# EAGLE design camera_final (EAGLE 7.5.0)
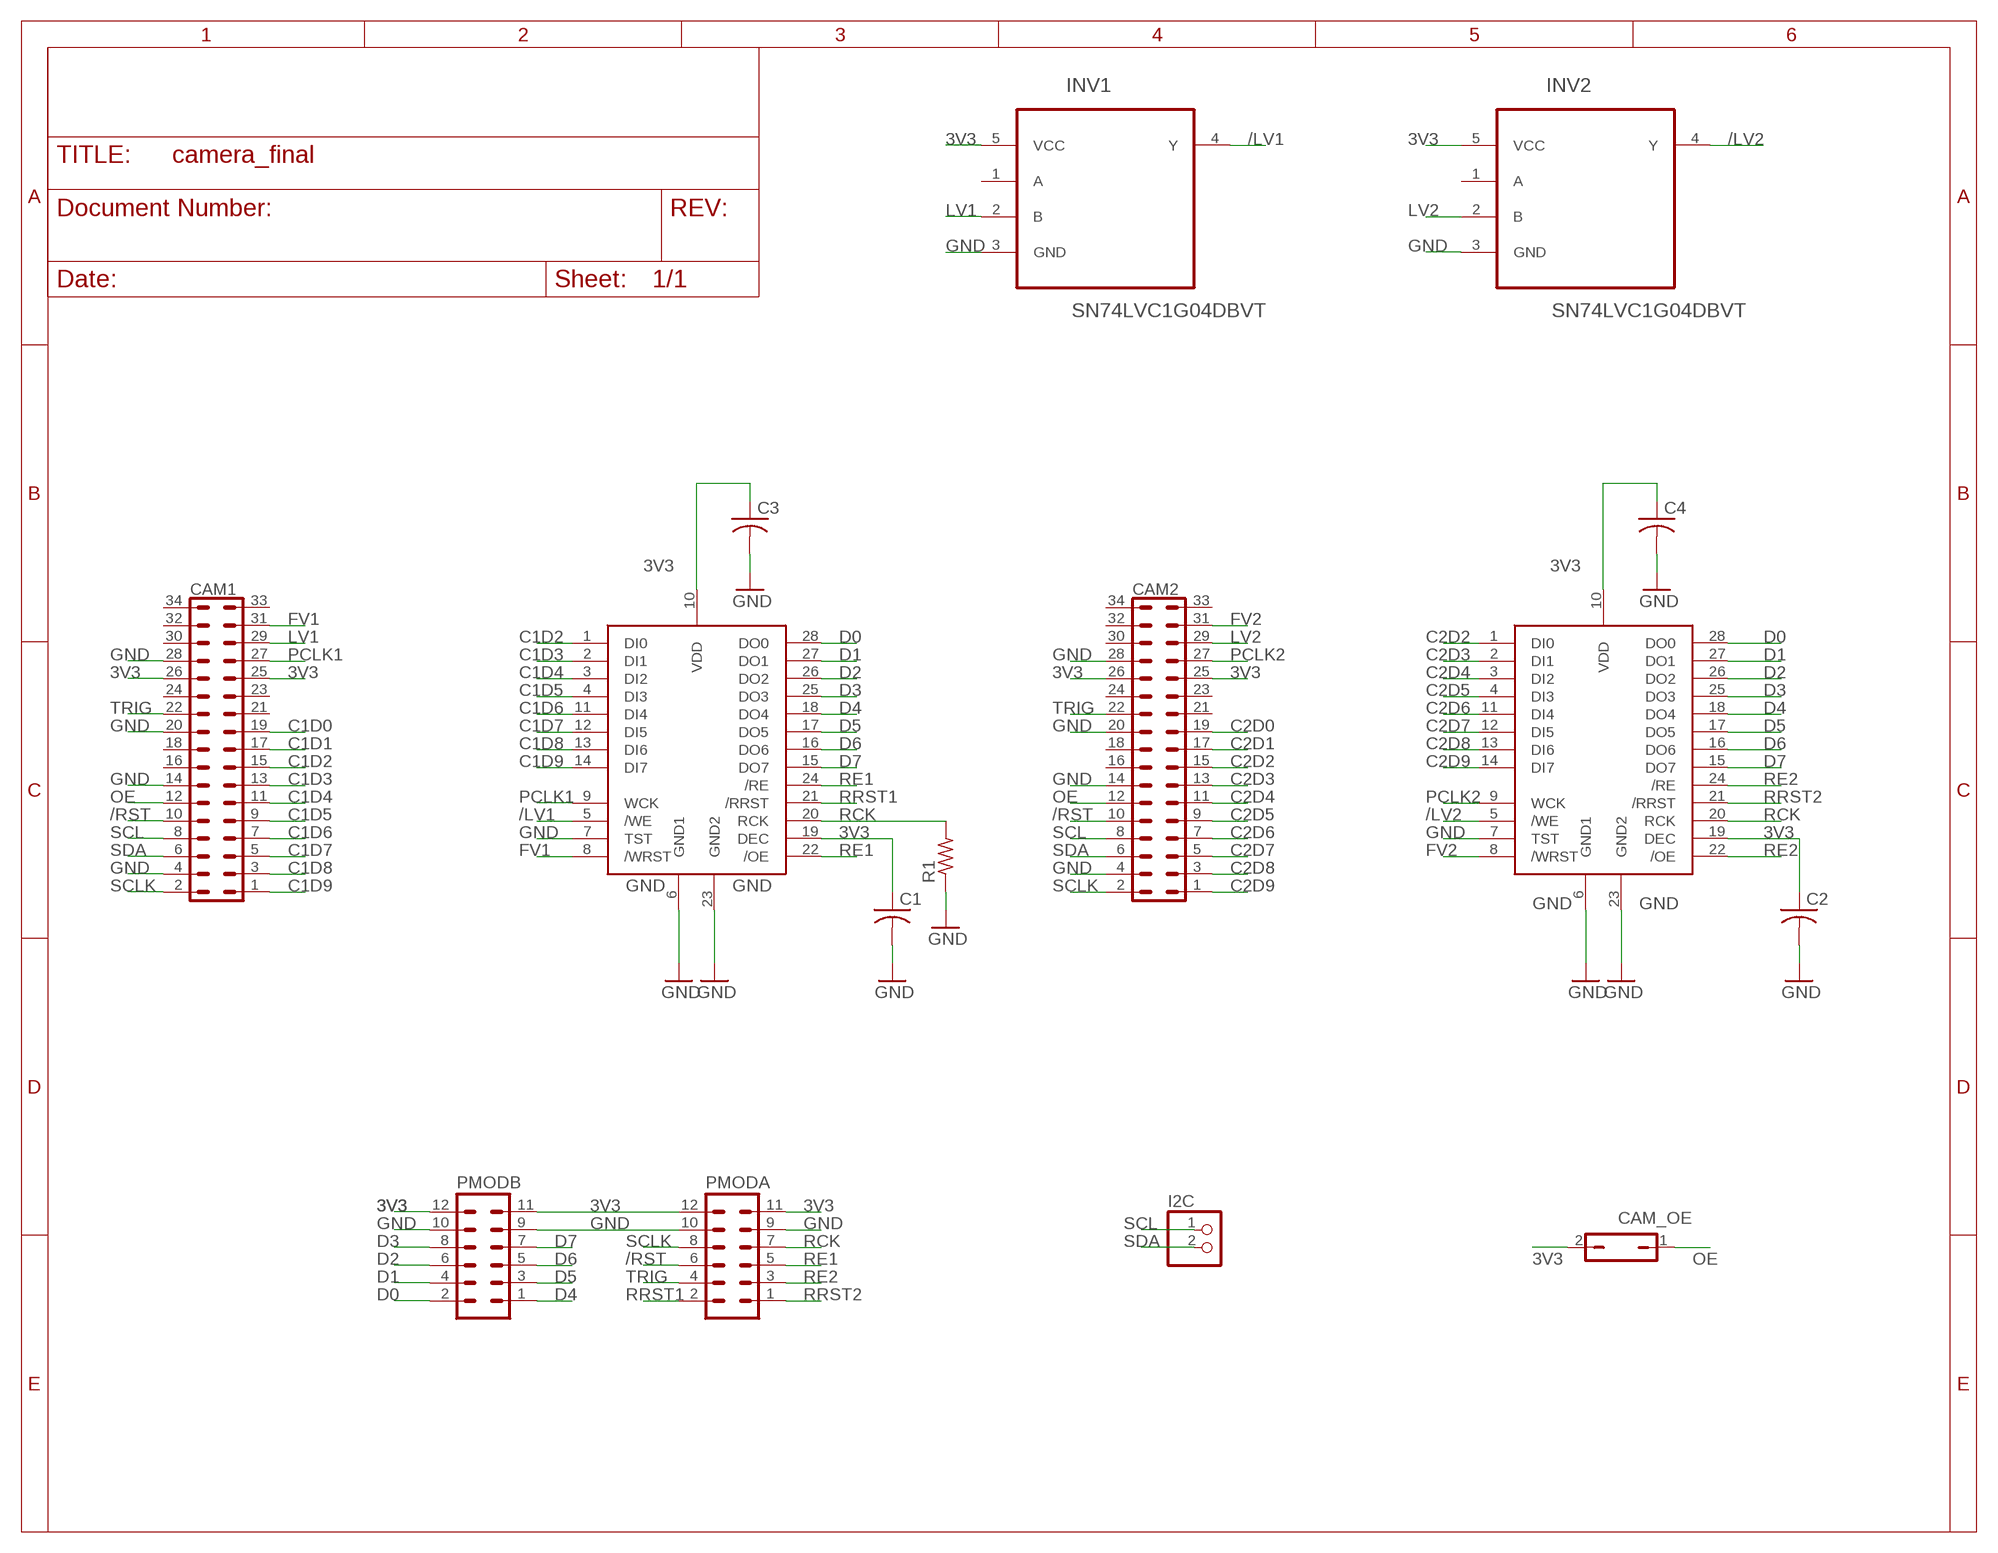
[diagram p0: schematic, sheet 1]

## Parts
C1  C-USC0805K  [C0805K]
C2  C-USC0805K  [C0805K]
C3  C-USC0805K  [C0805K]
C4  C-USC0805K  [C0805K]
CAM1  PHB_1MM27_2X17_SNT  [PHB_1MM27_2X17_SNT]
CAM2  PHB_1MM27_2X17_SNT  [PHB_1MM27_2X17_SNT]
CAM_OE  JP1Q  [JP1]
I2C  PINHD-1X2  [1X02]
INV1  SN74LVC1G04DBVT  SN74LVC1G08DBVT  [SOT95P280X145-5N]
INV2  SN74LVC1G04DBVT  SN74LVC1G08DBVT  [SOT95P280X145-5N]
PMODA  MA06-2  [MA06-2]
PMODB  MA06-2  [MA06-2]
R1  R-US_R0805  [R0805]
U$1  AL422B  [SOP28]
U$2  AL422B  [SOP28]

## Nets
3V3: C1.1 C2.1 C3.1 C4.1 CAM1.25 CAM1.26 CAM2.25 CAM2.26 CAM_OE.2 INV1.5(VCC) INV2.5(VCC) PMODA.11 PMODA.12 PMODB.11 PMODB.12 U$1.10(VDD) U$1.19(DEC) U$2.10(VDD) U$2.19(DEC)
/LV1: INV1.4(Y) U$2.5(/WE)
/LV2: INV2.4(Y) U$1.5(/WE)
/RST: CAM1.10 CAM2.10 PMODA.6
C1D0: CAM1.19
C1D1: CAM1.17
C1D2: CAM1.15 U$2.1(DI0)
C1D3: CAM1.13 U$2.2(DI1)
C1D4: CAM1.11 U$2.3(DI2)
C1D5: CAM1.9 U$2.4(DI3)
C1D6: CAM1.7 U$2.11(DI4)
C1D7: CAM1.5 U$2.12(DI5)
C1D8: CAM1.3 U$2.13(DI6)
C1D9: CAM1.1 U$2.14(DI7)
C2D0: CAM2.19
C2D1: CAM2.17
C2D2: CAM2.15 U$1.1(DI0)
C2D3: CAM2.13 U$1.2(DI1)
C2D4: CAM2.11 U$1.3(DI2)
C2D5: CAM2.9 U$1.4(DI3)
C2D6: CAM2.7 U$1.11(DI4)
C2D7: CAM2.5 U$1.12(DI5)
C2D8: CAM2.3 U$1.13(DI6)
C2D9: CAM2.1 U$1.14(DI7)
D0: PMODB.2 U$1.28(DO0) U$2.28(DO0)
D1: PMODB.4 U$1.27(DO1) U$2.27(DO1)
D2: PMODB.6 U$1.26(DO2) U$2.26(DO2)
D3: PMODB.8 U$1.25(DO3) U$2.25(DO3)
D4: PMODB.1 U$1.18(DO4) U$2.18(DO4)
D5: PMODB.3 U$1.17(DO5) U$2.17(DO5)
D6: PMODB.5 U$1.16(DO6) U$2.16(DO6)
D7: PMODB.7 U$1.15(DO7) U$2.15(DO7)
FV1: CAM1.31 U$2.8(/WRST)
FV2: CAM2.31 U$1.8(/WRST)
GND: C1.2 C2.2 C3.2 C4.2 CAM1.4 CAM1.14 CAM1.20 CAM1.28 CAM2.4 CAM2.14 CAM2.20 CAM2.28 INV1.3(GND) INV2.3(GND) PMODA.9 PMODA.10 PMODB.9 PMODB.10 R1.1 U$1.6(GND1) U$1.7(TST) U$1.23(GND2) U$2.6(GND1) U$2.7(TST) U$2.23(GND2)
LV1: CAM1.29 INV1.2(B)
LV2: CAM2.29 INV2.2(B)
OE: CAM1.12 CAM2.12 CAM_OE.1
PCLK1: CAM1.27 U$2.9(WCK)
PCLK2: CAM2.27 U$1.9(WCK)
RCK: PMODA.7 R1.2 U$1.20(RCK) U$2.20(RCK)
RE1: PMODA.5 U$2.22(/OE) U$2.24(/RE)
RE2: PMODA.3 U$1.22(/OE) U$1.24(/RE)
RRST1: PMODA.2 U$2.21(/RRST)
RRST2: PMODA.1 U$1.21(/RRST)
SCL: CAM1.8 CAM2.8 I2C.1
SCLK: CAM1.2 CAM2.2 PMODA.8
SDA: CAM1.6 CAM2.6 I2C.2
TRIG: CAM1.22 CAM2.22 PMODA.4
Unconnected: CAM1.16 CAM1.18 CAM1.21 CAM1.23 CAM1.24 CAM1.30 CAM1.32 CAM1.33 CAM1.34 CAM2.16 CAM2.18 CAM2.21 CAM2.23 CAM2.24 CAM2.30 CAM2.32 CAM2.33 CAM2.34 INV1.1(A) INV2.1(A)

## Library data of the parts
C1-C4 = adafruit:C-US: CAPACITOR, American symbol
CAM1 CAM2 = _hhn_con_pinhead_box_1mm27:PHB_1MM27_2X17_*: Pin Header Box-Type, 1.27mm/0.5"/50mil Pitch, 2x17 Circuits Note: see library description for an important note about THT-version
CAM_OE = jumper:JP1Q: JUMPER
I2C = pinhead:PINHD-1X2: PIN HEADER
INV1 INV2 = Texas Instruments_By_element14_Batch_1:SN74LVC1G08DBVT: SINGLE 2-INPUT POSITIVE-AND GATE; MPN: SN74LVC1G08DBVT; OC_FARNELL: 1236324; OC_NEWARK: 32H6345; PACKAGE: SOT-23-5; SUPPLIER: Texas Instruments
PMODA PMODB = con-lstb:MA06-2: PIN HEADER; OC_FARNELL: unknown; OC_NEWARK: unknown
R1 = rcl:R-US_: RESISTOR, American symbol
U$1 U$2 = AL422B:AL422B: Averlogic AL422B 3Mbit FIFO

## Board
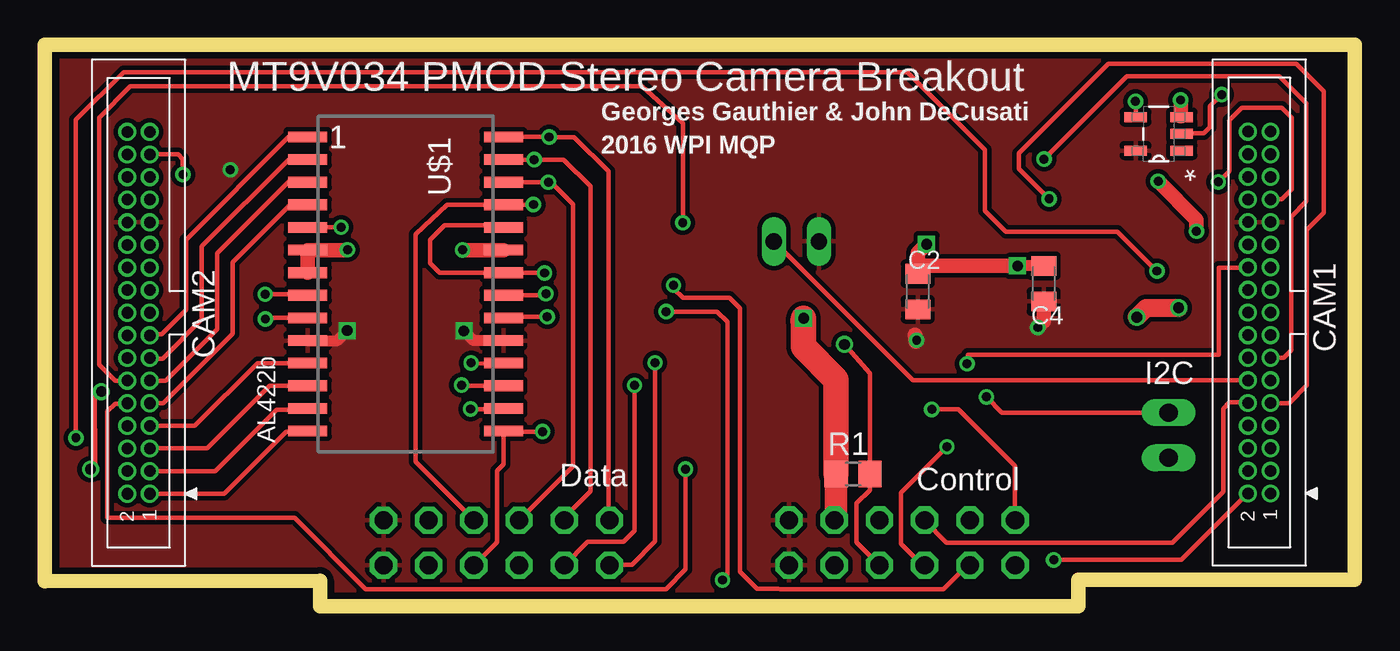
[diagram p1: board, top side]
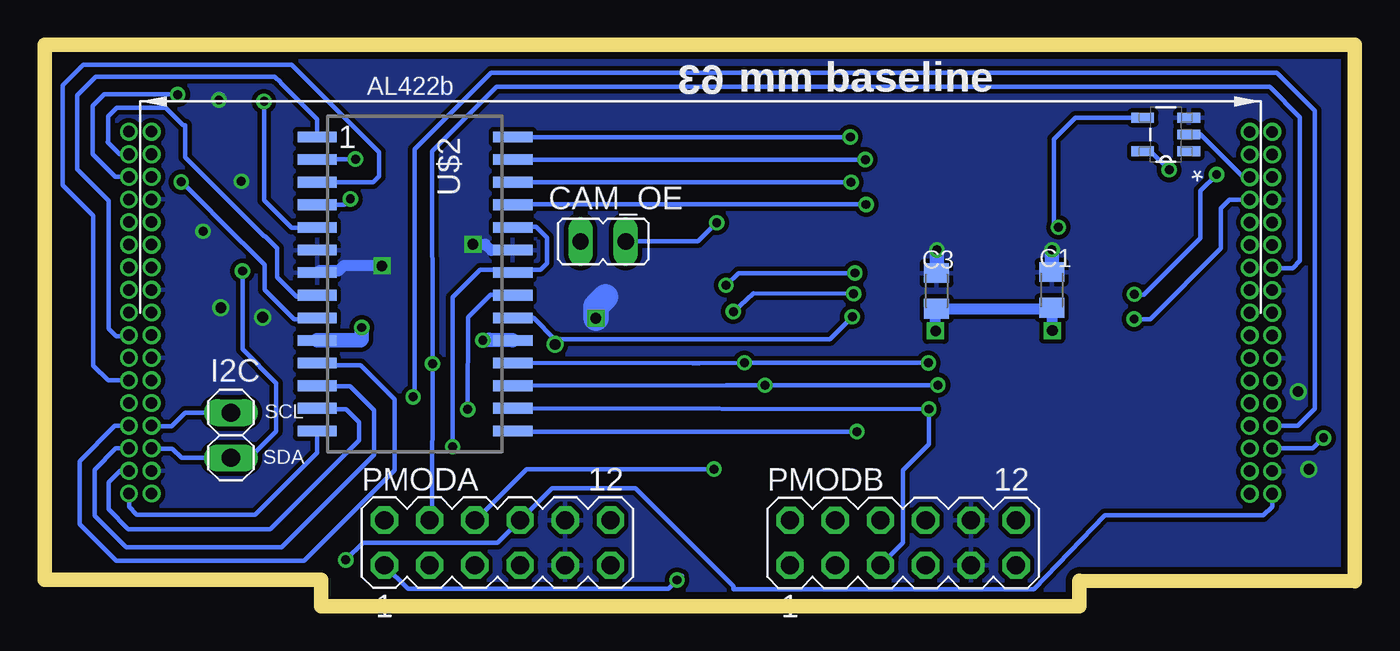
[diagram p2: board, bottom side, seen from below]

Size 73.61 x 31.54 mm. Coordinates in mm from the lower left corner, seen from the top.
Outline: 1.65,31.54 0,31.54 0.01,1.41 15.48,1.43 15.48,0 58.08,0 58.08,1.49 73.61,1.49 73.61,31.53 1.66,31.54
Copper layers (1+16): Top 0.0356mm / dielectric 1.5011mm / Bottom 0.0356mm
Design rules "OSHpark *": minimum track width 6mil, minimum drill 13mil, track to track 6mil, track to pad 6mil, pad to pad 6mil, via to via 6mil, smd to smd 6mil, copper to edge 15mil, drill to drill 6mil, minimum pad ring 7mil, minimum via ring 7mil, stop-mask expansion 3mil, vias tented up to drill 0mil, thermal gap 10mil

### Footprints (pad centres in the part's own frame; a part is rotated, then mirrored left to right if it is on the bottom)
C0805K = smd 1.1 x 1.4: 1 -1,0; 2 1,0
PHB_1MM27_2X17_SNT = drill 0.65: 1 -10.16,-0.635; 2 -10.16,0.635; 3 -8.89,-0.635; 4 -8.89,0.635; 5 -7.62,-0.635; 6 -7.62,0.635; 7 -6.35,-0.635; 8 -6.35,0.635; 9 -5.08,-0.635; 10 -5.08,0.635; 11 -3.81,-0.635; 12 -3.81,0.635; 13 -2.54,-0.635; 14 -2.54,0.635; 15 -1.27,-0.635; 16 -1.27,0.635; 17 0,-0.635; 18 0,0.635; 19 1.27,-0.635; 20 1.27,0.635; 21 2.54,-0.635; 22 2.54,0.635; 23 3.81,-0.635; 24 3.81,0.635; 25 5.08,-0.635; 26 5.08,0.635; 27 6.35,-0.635; 28 6.35,0.635; 29 7.62,-0.635; 30 7.62,0.635; 31 8.89,-0.635; 32 8.89,0.635; 33 10.16,-0.635; 34 10.16,0.635
JP1 = drill 0.914 long: 1 0,-1.27; 2 0,1.27
1X02 = drill 1.016 long: 1 -1.27,0; 2 1.27,0
SOT95P280X145-5N = smd 1.27 x 0.559: 1 -1.295,0.94; 2 -1.295,0; 3 -1.295,-0.94; 4 1.295,-0.94; 5 1.295,0.94
MA06-2 = drill 1.016 octagon: 1 -6.35,-1.27; 2 -6.35,1.27; 3 -3.81,-1.27; 4 -3.81,1.27; 5 -1.27,-1.27; 6 -1.27,1.27; 7 1.27,-1.27; 8 1.27,1.27; 9 3.81,-1.27; 10 3.81,1.27; 11 6.35,-1.27; 12 6.35,1.27
R0805 = smd 1.3 x 1.5: 1 -0.95,0; 2 0.95,0
SOP28 = smd 0.6 x 2.2: 1 -8.255,-5.5; 2 -6.985,-5.5; 3 -5.715,-5.5; 4 -4.445,-5.5; 5 -3.175,-5.5; 6 -1.905,-5.5; 7 -0.635,-5.5; 8 0.635,-5.5; 9 1.905,-5.5; 10 3.175,-5.5; 11 4.445,-5.5; 12 5.715,-5.5; 13 6.985,-5.5; 14 8.255,-5.5; 15 8.255,5.5; 16 6.985,5.5; 17 5.715,5.5; 18 4.445,5.5; 19 3.175,5.5; 20 1.905,5.5; 21 0.635,5.5; 22 -0.635,5.5; 23 -1.905,5.5; 24 -3.175,5.5; 25 -4.445,5.5; 26 -5.715,5.5; 27 -6.985,5.5; 28 -8.255,5.5

### Placement (x,y rotation side)
C1  17.03,17.77 90 bottom
C2  49.05,17.67 90 top
C3  23.5,17.71 90 bottom
C4  56.13,18.12 90 top
CAM1  68.23,16.49 90 top
CAM2  5.28,16.48 90 top
CAM_OE  42.24,20.49 90 bottom
I2C  63.14,9.61 270 bottom
INV1  62.59,26.53 180 top
INV2  10.63,26.49 180 bottom
PMODA  48.17,3.57 0 bottom
PMODB  25.39,3.57 0 bottom
R1  45.42,7.43 0 top
U$1  20.28,18.1 270 top
U$2  52.81,18.1 270 bottom

### Tracks (layer width: path | path; a pad name or v marks a point on that pad's centre or on a via)
3V3  (via drill 0.5, 0.6)
  Top 0.254: v10.44,24.51 10.41,24.51 10.35,24.44
  Top 0.61: U$1.19 24.1,14.92 v23.56,15.47 | U$1.10 16.44,14.92 v17,15.48
  Top 0.813: v55.79,15.65 56.13,15.99 C4.1 | v48.99,14.94 48.9,15.23 48.96,14.84
  Bottom 0.254: INV2.5 11.48,25.55 v10.44,24.51
  Bottom 0.61: v23.56,15.47 23.56,16.65 C3.1 17.08,16.71 C1.1 17,16.74 v17,15.48
  Bottom 0.813: U$2.10 58.29,14.94 55.86,14.94 55.79,15 v55.79,15.65 | U$2.19 48.63,14.95 v48.99,14.94
  pour Top (isolate 0.254, rank 6): 0.84,31.26 0.84,1.82 1.39,1.5 15.53,1.5 15.76,1.27 15.76,0.28 15.87,0.17 57.75,0.17 57.83,0.25 57.83,1.12 58.17,1.46 73.11,1.46 73.37,1.73 73.37,31.17 73.22,31.33 1.24,31.33 1.18,31.26
/LV1  (via drill 0.5)
  Top 0.254: INV1.4 61.29,28.11 v61.28,28.35
  Bottom 0.254: v61.28,28.35 61.28,22.79 59.74,21.25 58.33,21.25 U$2.5
/LV2  (via drill 0.5)
  Top 0.254: v16.66,21.28 14.79,21.28 U$1.5
  Bottom 0.254: INV2.4 15.72,27.43 16.92,26.23 16.92,21.54 v16.66,21.28
/RST  (via drill 0.5)
  Top 0.254: PMODA.6 49.44,4.8 50.67,3.57 63.34,3.57 66.21,6.44 66.21,11.1 66.56,11.45 67.56,11.45 CAM1.10 | v36.01,7.7 36.01,2.07 34.91,0.97 18.03,0.97 14.04,4.96 3.53,4.96 3.53,10.94 3.96,11.37 4.62,11.37 CAM2.10
  Bottom 0.254: PMODA.6 49.4,4.84 46.54,7.7 37.89,7.7 v36.01,7.7
C1D2
  Bottom 0.254: U$2.1 58.31,27.36 60.36,29.41 60.67,29.73 70.73,29.73 71.76,28.69 71.76,24.53 70.01,22.78 70.01,15.6 69.59,15.18 68.92,15.18 CAM1.15
C1D3  (via drill 0.5)
  Top 0.254: CAM1.13 69.61,13.95 70.04,14.38 70.04,21.89 70.88,22.73 70.88,28.24 69.37,29.76 60.79,29.76 v56.14,25.11
  Bottom 0.254: v56.14,25.11 58.28,25.11 U$2.2
C1D4
  Bottom 0.254: CAM1.11 70.05,12.68 70.88,13.51 70.88,21.92 72.59,23.64 72.59,29.26 71.45,30.4 59.72,30.4 54.82,25.5 54.82,24.15 55.15,23.82 U$2.3 58.24,23.75
C1D5  (via drill 0.5)
  Top 0.254: CAM1.9 69.92,11.41 70.91,12.4 70.91,21.15 71.86,22.09 71.86,28.91 70.3,30.47 59.75,30.47 54.73,25.45 54.73,24.57 v56.43,22.87
  Bottom 0.254: 58.28,22.57 U$2.4 56.76,22.55 v56.43,22.87
C1D6
  Bottom 0.254: CAM1.7 69.65,10.14 71.64,8.16 71.64,4.61 69.59,2.56 59.02,2.56 53.95,7.64 53.95,11.64 55.85,13.54 58.19,13.54 U$2.11
C1D7
  Bottom 0.254: CAM1.5 69.6,8.87 70.8,7.68 70.8,5.1 69.02,3.32 60.28,3.32 55.1,8.51 55.1,11.02 56.43,12.36 58.28,12.36 U$2.12
C1D8
  Bottom 0.254: CAM1.3 69.37,7.6 70.01,6.97 70.01,5.44 68.9,4.33 60.94,4.33 55.95,9.32 55.95,10.34 56.68,11.08 58.27,11.08 U$2.13
C1D9
  Bottom 0.254: U$2.14 58.31,8.61 61.78,5.14 68.43,5.14 68.87,5.58 CAM1.1
C2D2
  Top 0.254: U$1.1 13.72,26.35 7.95,20.58 7.95,16.64 6.59,15.28 5.98,15.28 CAM2.15
C2D3
  Top 0.254: U$1.2 13.71,25.08 8.83,20.21 8.83,16.11 6.63,13.91 5.95,13.91 CAM2.13
C2D4
  Top 0.254: CAM2.11 6.82,12.67 9.71,15.56 9.71,19.83 13.76,23.88 14.71,23.88 U$1.3
C2D5
  Top 0.254: CAM2.9 6.67,11.4 10.57,15.3 10.57,19.33 13.74,22.49 14.73,22.49 U$1.4
C2D6
  Top 0.254: CAM2.7 8.44,10.13 11.97,13.66 U$1.11
C2D7
  Top 0.254: CAM2.5 9.13,8.86 12.64,12.37 U$1.12
C2D8
  Top 0.254: CAM2.3 9.58,7.59 13.04,11.05 14.71,11.05 U$1.13
C2D9
  Top 0.254: CAM2.1 10.08,6.32 13.57,9.81 14.75,9.81 U$1.14
D0  (via drill 0.5)
  Top 0.254: U$1.28 v28.35,26.35 29.76,26.35 31.69,24.42 31.69,4.88 PMODB.2
  Bottom 0.254: v28.35,26.35 U$2.28
D1  (via drill 0.5)
  Top 0.254: U$1.27 v27.51,25.08 | v27.51,25.08 | v27.51,25.08 29.16,25.08 30.67,23.57 30.67,6.46 29.2,4.99 PMODB.4
  Bottom 0.254: v27.51,25.08 U$2.27
D2  (via drill 0.5)
  Top 0.254: U$1.26 v28.3,23.81 28.46,23.81 29.7,22.58 29.7,7.87 PMODB.6
  Bottom 0.254: v28.3,23.81 U$2.26
D3  (via drill 0.5)
  Top 0.254: v27.46,22.56 27.46,22.54 U$1.25 22.63,22.55 20.84,20.88 20.84,8.12 PMODB.8
  Bottom 0.254: v27.46,22.56 47.31,22.56 U$2.25
D4  (via drill 0.5)
  Top 0.254: U$1.18 24.02,13.62 v23.97,13.66 | PMODB.1 31.78,2.34 32.99,2.34 34.29,3.64 v34.29,13.67
  Bottom 0.254: v23.97,13.66 v34.29,13.67 | v34.29,13.67 47.31,13.64 U$2.18 | v34.29,13.67 36.82,13.65 37.21,13.65
D5  (via drill 0.5)
  Top 0.254: U$1.17 23.62,12.38 v23.42,12.42 | PMODB.3 30.52,3.61 32.52,3.61 33.14,4.23 v33.14,12.41
  Bottom 0.254: v23.42,12.42 v33.14,12.41 | v33.14,12.41 35.34,12.41 | 35.34,12.41 U$2.17 | v33.14,12.41 35.24,12.41 35.34,12.41
D6  (via drill 0.5)
  Top 0.254: U$1.16 26.42,11.06 v23.93,11.08
  Bottom 0.254: U$2.16 47.31,11.13 v23.93,11.08 23.93,9.11 25.4,7.64 25.4,3.56 PMODB.5
D7  (via drill 0.5)
  Top 0.254: v27.97,9.81 25.74,9.8 U$1.15 25.78,7.99 25.42,7.62 25.42,3.61 25.37,3.56 25.37,3.55 PMODB.7
  Bottom 0.254: v27.97,9.81 47.31,9.81 U$2.15
FV1
  Bottom 0.254: CAM1.31 69.38,25.38 70.06,26.06 70.06,26.08 70.04,26.1 70.04,27.52 69.56,27.99 66.82,27.99 65.82,27 65.7,27 65.7,25.21 61.28,20.79 61.23,20.79 60.55,20.11 60.55,18.48 59.45,17.38 58.39,17.38 U$2.8 58.33,17.49
FV2  (via drill 0.5)
  Top 0.254: CAM2.31 7.51,25.37 7.78,25.11 v7.78,24.24 | v12.39,17.52 14.72,17.52 U$1.8
  Bottom 0.254: v7.78,24.24 8.68,23.34 8.68,20.67 11.86,17.48 12.35,17.48 v12.39,17.52
GND  (via drill 0.5, 0.6)
  Top 0.254: 63.83,27.52 INV1.3 | v3.2,12.06 2.82,12.06 2.85,7.95 2.54,7.66 v2.58,7.69
  Top 0.61: 49.51,20.3 v49.55,20.33 | C4.2 54.84,19.12 v54.66,19.12 54.28,19.05
  Top 0.813: U$1.23 23.5,20 v23.49,20.01 | v17.02,20.02 17,20 U$1.6 U$1.7 | 49.51,20.3 49.05,19.84 C2.2 49.5,19.12 v54.66,19.12 | v62.56,23.86 64.71,21.71 v64.71,21.06 | 63.83,27.52 63.83,28.42 v63.82,28.43
  Top 1.016: v61.36,16.23 61.88,16.76 v63.7,16.76
  Top 1.27: PMODA.10 44.47,4.95 R1.1
  Top 1.422: R1.1 44.47,12.73 42.63,14.57 v42.64,16.17 42.61,16.01
  Bottom 0.61: v49.55,20.33 48.85,20.33 48.51,19.99 | v54.66,19.12 56.8,19.12 57.09,18.83 58.21,18.83 U$2.7
  Bottom 0.813: v23.49,20.01 C3.2 | v17.02,20.02 17.02,18.78 C1.2 | v63.82,28.43 63.82,28.47 63.79,28.49
  Bottom 1.422: v42.64,16.17 42.63,16.84 42.09,17.38
  pour Bottom (isolate 0.254): 0.81,31.51 0.81,1.46 0.98,1.35 15.26,1.35 15.49,1.12 15.49,0.13 15.64,-0.02 58.13,-0.02 58.13,1.5 73.64,1.5 73.68,1.46 73.68,31.51 73.64,31.8 0.84,31.77
LV1  (via drill 0.5)
  Top 0.254: INV1.2 63.93,26.48 64.01,26.56 65.13,26.56 65.46,26.89 65.46,28.07 v66.12,28.73
  Bottom 0.254: CAM1.29 69.63,24.11 70.9,25.38 70.9,28.1 70.26,28.74 66.14,28.74 v66.12,28.73
LV2
  Bottom 0.254: CAM2.29 6.27,24.1 8.68,26.52 9.31,26.52 INV2.2
OE  (via drill 0.5)
  Top 0.254: CAM2.12 3.98,12.66 3.07,13.57 3.07,27.44 4.83,29.2 29.18,29.2 29.57,29.19 33.56,29.19 35.85,27.12 v35.85,21.54 | 67.58,12.7 CAM1.12 48.77,12.68 CAM_OE.1
  Bottom 0.254: v35.85,21.54 36.9,20.49 CAM_OE.1
PCLK1  (via drill 0.5)
  Top 0.254: CAM1.27 69.49,22.84 70.06,23.42 70.06,27.43 69.49,28 67.25,28 66.55,27.3 66.55,24.44 v65.94,23.83
  Bottom 0.254: v65.94,23.83 65.91,23.83 62.5,20.42 62.49,20.42 61.24,19.17 61.24,17.76 59.59,16.11 58.39,16.11 U$2.9 58.32,16.21
PCLK2  (via drill 0.5)
  Top 0.254: v12.41,16.13 12.47,16.19 U$1.9
  Bottom 0.254: CAM2.27 7.06,22.84 7.54,22.36 7.54,20.09 11.5,16.13 v12.41,16.13
RCK  (via drill 0.5, 0.6)
  Top 0.254: v28.24,16.26 25.85,16.26 U$1.20 | PMODA.7 45.62,3.59 45.62,5.77 46.37,6.52 R1.2 46.37,13.08 v44.93,14.7
  Bottom 0.254: 47.21,16.1 U$2.20 46.15,16.19 44.93,14.97 v44.93,14.7 44.64,14.99 29.5,14.99 v28.24,16.26
RE1  (via drill 0.5)
  Top 0.254: PMODA.5 49.32,2.3 48.12,3.5 48.12,6.39 v50.69,8.96
  Bottom 0.254: v50.69,8.96 50.69,17.35 49.15,18.88 47.46,18.88 | 47.46,18.88 U$2.22 | 47.46,18.88 45.74,18.88 45.37,19.25 45.37,20.69 46.01,21.32 47.26,21.32 U$2.24
RE2  (via drill 0.5)
  Top 0.254: PMODA.3 51.83,2.3 50.49,0.96 41.3,0.96 41.24,0.98 40.03,0.98 39.07,1.94 39.07,16.74 38.49,17.31 35.85,17.31 35.33,17.84 v35.33,18.03 | v28.08,18.71 28.06,18.73 U$1.22 22.18,18.73 21.66,19.25 21.66,20.57 22.48,21.38 25.67,21.38 U$1.24
  Bottom 0.254: v28.08,18.71 34.64,18.71 v35.33,18.03
RRST1  (via drill 0.5)
  Top 0.254: v49.84,11.05 51.35,11.05 54.52,7.88 PMODA.2
  Bottom 0.254: v49.84,11.05 49.81,16.24 48.55,17.51 47.35,17.51 U$2.21
RRST2  (via drill 0.5)
  Top 0.254: v28.16,17.55 27.99,17.45 U$1.21 | v34.92,16.55 37.79,16.55 38.36,15.97 38.36,1.76 v38.08,1.48
  Bottom 0.254: PMODA.1 53.2,0.98 38.55,0.98 37.82,1.71 v38.08,1.48 | v34.92,16.55 33.77,17.57 v28.16,17.55
SCL  (via drill 0.5)
  Top 0.254: v52.9,11.75 53.78,10.88 I2C.1
  Bottom 0.254: CAM2.8 3.23,10.13 2.27,11.09 2.27,27.83 4.39,29.95 48.53,29.95 52.81,25.67 52.81,11.84 v52.9,11.75 | I2C.1 65.71,10.88 66.47,10.12 67.57,10.12 CAM1.8
SCLK  (via drill 0.5)
  Top 0.254: v56.69,2.6 63.87,2.6 CAM1.2
  Bottom 0.254: CAM2.2 4.65,5.6 5.15,5.1 14.06,5.1 18.04,0.96 34.91,0.96 34.91,1.12 40.42,6.64 45.11,6.64 PMODA.8 46.91,4.82 48.16,3.57 55.72,3.57 v56.69,2.6
SDA  (via drill 0.5)
  Top 0.254: v62.49,18.83 60.27,21.04 53.99,21.04 52.83,22.2 52.83,25.64 48.48,29.99 4.44,29.99 1.77,27.32 v1.77,9.45
  Bottom 0.254: v62.49,18.83 62.49,14.43 60.59,12.53 60.59,9.83 62.06,8.36 63.12,8.36 I2C.2 65.92,8.34 66.43,8.85 67.58,8.85 CAM1.6 | CAM2.6 2.36,8.86 v1.77,9.45
TRIG  (via drill 0.5)
  Top 0.254: v51.82,13.61 51.86,14.13 65.97,14.13 65.97,19.02 67.6,19.02 CAM1.22
  Bottom 0.254: PMODA.4 51.83,4.99 v51.82,13.61 51.83,25.55 48.22,29.16 4.8,29.16 3.09,27.45 3.09,19.39 3.49,18.99 4.62,18.99 CAM2.22

### Text on the board
tNames: MT9V034 PMOD Stereo Camera Breakout | Georges Gauthier & John DeCusati | 2016 WPI MQP | I2C | AL422b | Data | Control
bNames: mm baseline | AL422b | SCL | SDA